# EAGLE design lora-sensor (EAGLE 9.6.2)
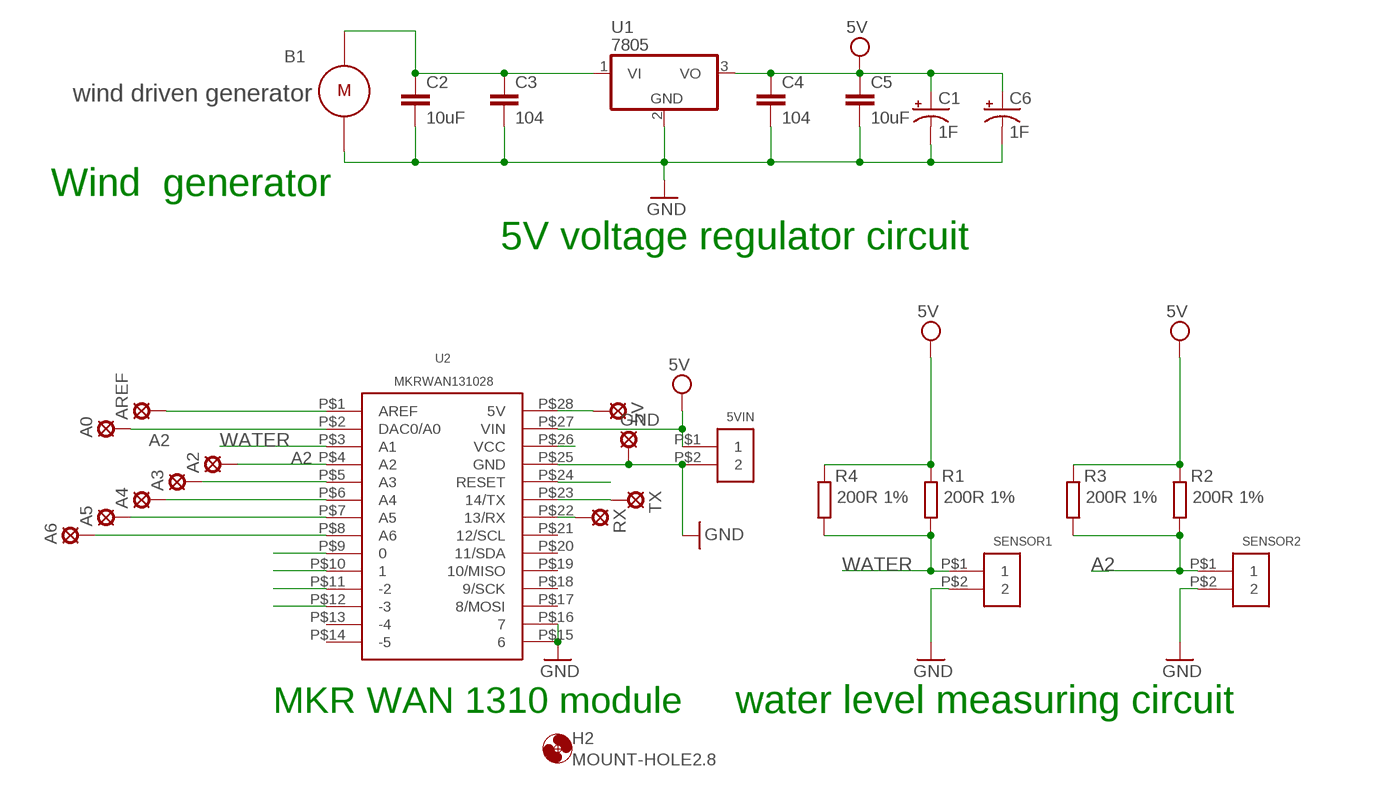
[diagram p0: schematic, sheet 1]

## Parts
5V  SE14  [SE14]
5VIN  0-190ΩCON2  [CON-2]
A0  SE14  [SE14]
A2  SE14  [SE14]
A3  SE14  [SE14]
A4  SE14  [SE14]
A5  SE14  [SE14]
A6  SE14  [SE14]
AREF  SE14  [SE14]
B1  wind driven generator  MOTOR  [MOTOR]
C1  1F  CPOL-USE3.5-8  [E3,5-8]
C2  10uF  C-EU025-030X050  [C025-030X050]
C3  104  C-EU025-030X050  [C025-030X050]
C4  104  C-EU025-030X050  [C025-030X050]
C5  10uF  C-EU025-030X050  [C025-030X050]
C6  1F  CPOL-USE3.5-8  [E3,5-8]
GND  SE14  [SE14]
H2  MOUNT-HOLE2.8  [2,8]
R1  200R 1%  R-EU_0309/12  [0309/12]
R2  200R 1%  R-EU_0309/12  [0309/12]
R3  200R 1%  R-EU_0309/12  [0309/12]
R4  200R 1%  R-EU_0309/12  [0309/12]
RX  SE14  [SE14]
SENSOR1  0-190ΩCON2  [CON-2]
SENSOR2  0-190ΩCON2  [CON-2]
TX  SE14  [SE14]
U1  7805  7812TV  [TO220V]
U2  MKRWAN131028  [28]

## Nets
5V [thicker]: 5VIN.P$1 C1.+ C4.1 C5.1 C6.+ U1.3(VO) U2.P$27(VIN)
A2 [thicker]: A2.MP R2.2 R3.2 SENSOR2.P$1 U2.P$4(A2)
GND [thicker]: 5VIN.P$2 B1.P$2 C1.- C2.2 C3.2 C4.2 C5.2 C6.- GND.MP SENSOR1.P$2 SENSOR2.P$2 U1.2(GND) U2.P$15 U2.P$16 U2.P$25(GND)
N$1 [thicker]: B1.P$1 C2.1 C3.1 U1.1(VI)
N$2 [thicker]: U2.P$24(RESET)
N$5 [thicker]: A3.MP U2.P$5(A3)
N$6 [thicker]: A4.MP U2.P$6(A4)
N$7 [thicker]: A5.MP U2.P$7(A5)
N$8 [thicker]: A6.MP U2.P$8(A6)
N$9 [thicker]: U2.P$9
N$10 [thicker]: U2.P$10
N$11 [thicker]: U2.P$11(-2)
N$12 [thicker]: U2.P$12(-3)
N$13 [thicker]: A0.MP U2.P$2(DAC0/A0)
N$14 [thicker]: AREF.MP U2.P$1(AREF)
N$15 [thicker]: U2.P$26(VCC)
N$16: 5V.MP U2.P$28(5V)
N$17 [thicker]: TX.MP U2.P$23(14/TX)
N$18 [thicker]: RX.MP U2.P$22(13/RX)
WATER [thicker]: R1.2 R2.1 R3.1 R4.2 SENSOR1.P$1 U2.P$3(A1) ; supply symbol labelled 5V
WATER1 [thicker]: R1.1 R4.1 ; supply symbol labelled 5V
Unconnected: U2.P$13(-4) U2.P$14(-5) U2.P$17(8/MOSI) U2.P$18(9/SCK) U2.P$19(10/MISO) U2.P$20(11/SDA) U2.P$21(12/SCL)

## Notes on the sheet
- Wind  generator
- 5V voltage regulator circuit
- MKR WAN 1310 module | water level measuring circuit

## Library data of the parts
5V A0 A2-A6 AREF GND RX TX = solpad:SE14: SOLDER PAD E1553, drill 1,4mm, distributor Buerklin, 07F820
5VIN SENSOR1 SENSOR2 = untitled:0-190Ω
B1 = untitled:MOTOR
C1 C6 = adafruit:CPOL-US: POLARIZED CAPACITOR, American symbol
C2-C5 = rcl:C-EU: CAPACITOR, European symbol; SPICEPREFIX: C
H2 = holes:MOUNT-HOLE: MOUNTING HOLE with drill center marker
R1-R4 = rcl:R-EU_: RESISTOR, European symbol; SPICEPREFIX: R
U1 = linear:78*: Positive VOLTAGE REGULATOR Source: http://cache.national.com/ds/LM/LM78L05.pdf http://www.fairchildsemi.com/ds/LM/LM7805.pdf
U2 = untitled:MKRWAN1310

## Net classes
1 thicker: width 0.203 mm, clearance 0.102 mm

## Board
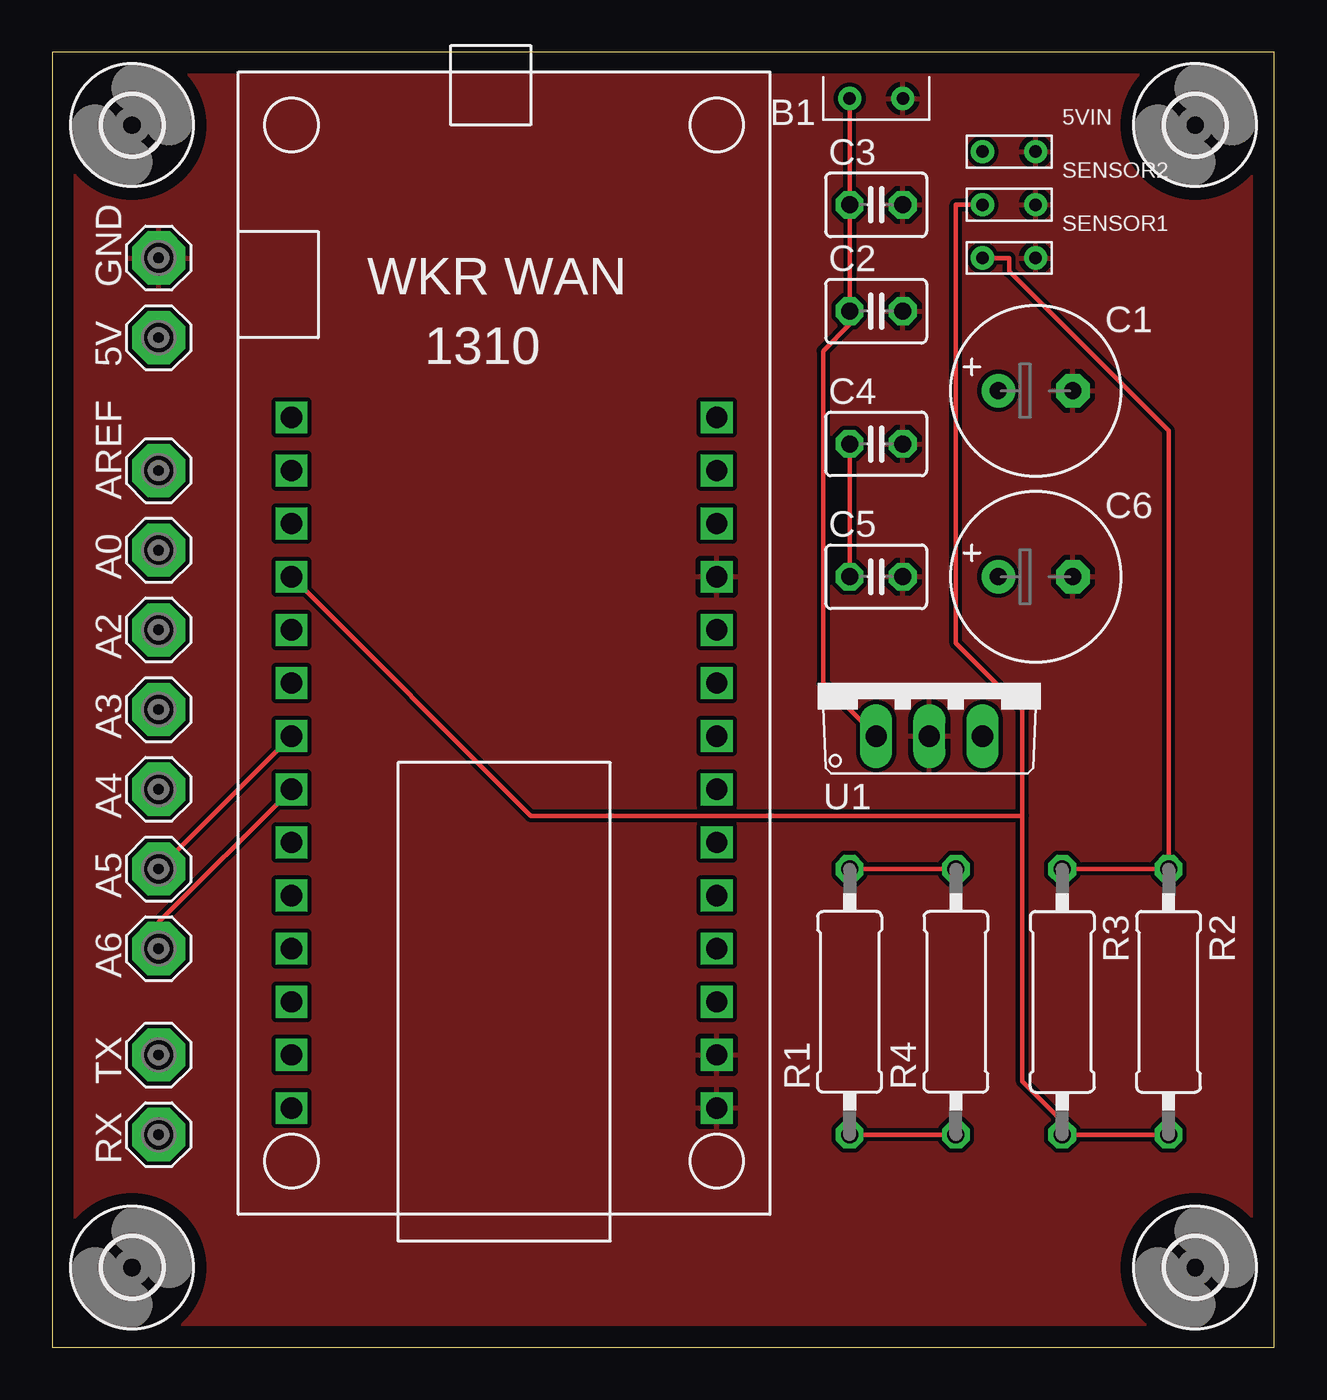
[diagram p1: board, top side]
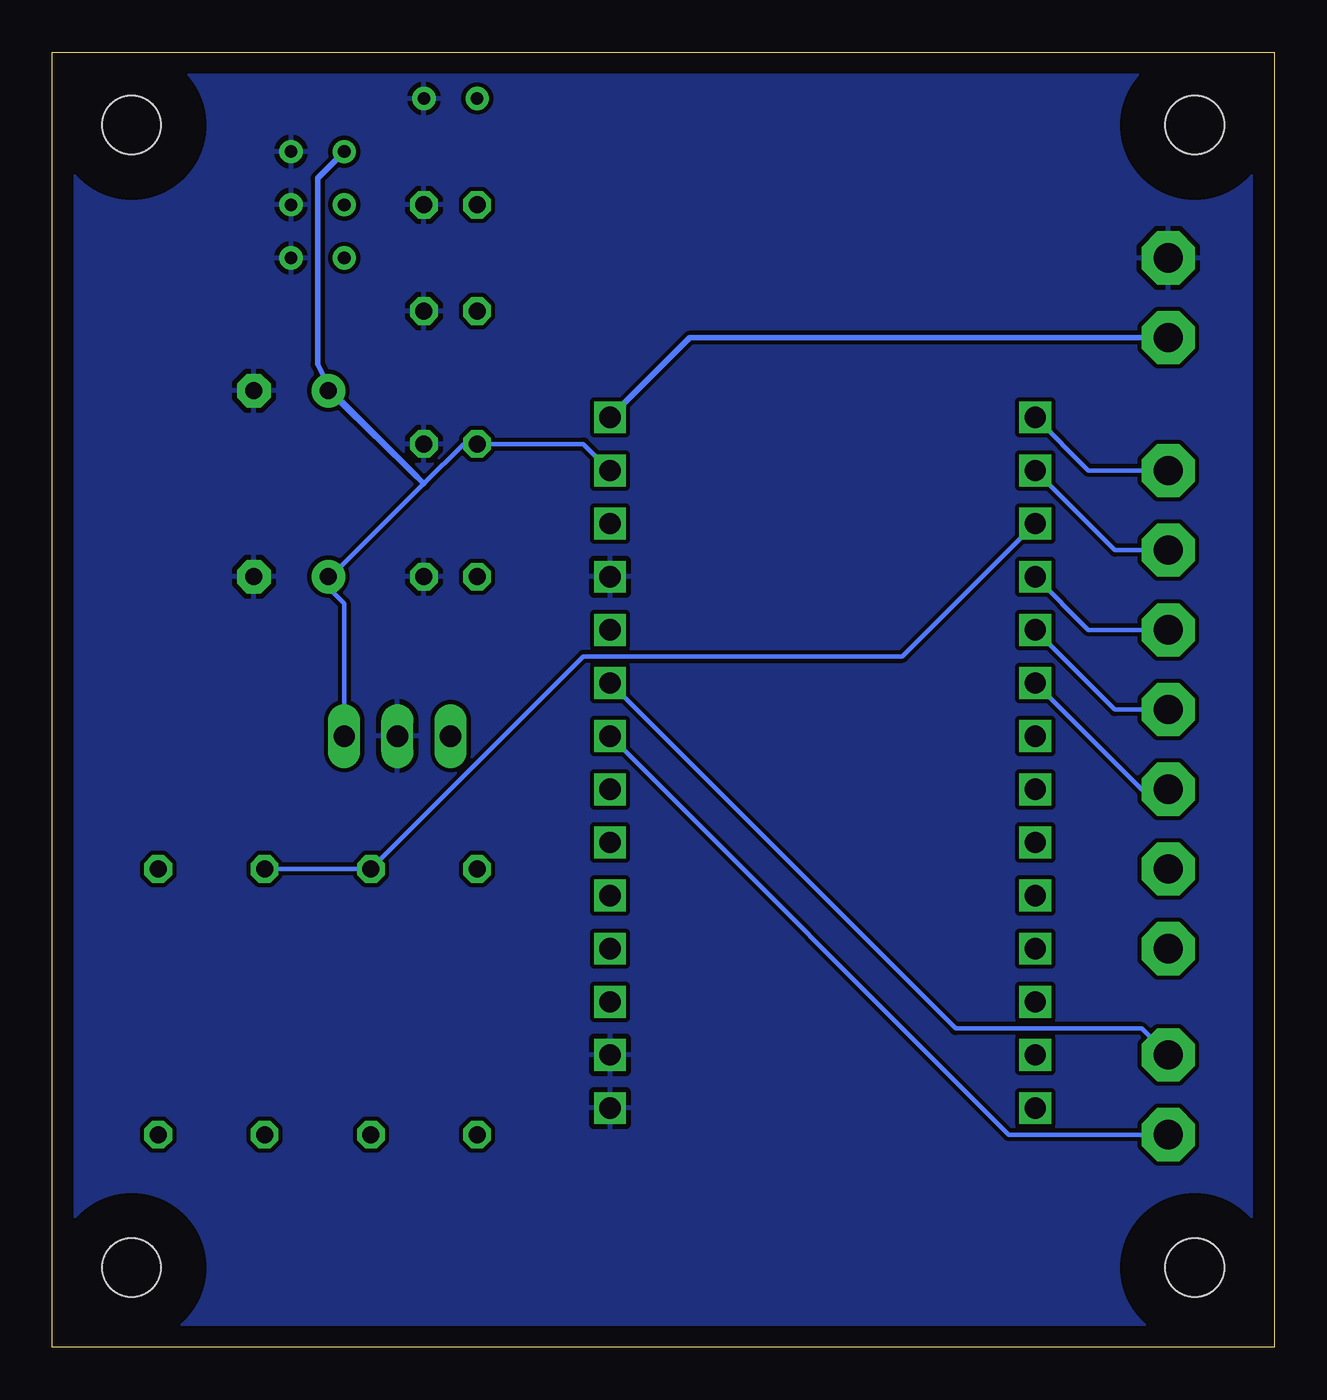
[diagram p2: board, bottom side, seen from below]

Size 58.4 x 61.9 mm. Coordinates in mm from the lower left corner, seen from the top.
Outline: 0,0 58.4,0 58.4,61.9 0,61.9 0,0
Copper layers (1*16): Top 0.035mm / dielectric 1.5mm / Bottom 0.035mm
Design rules "PCBWay": minimum track width 6mil, minimum drill 0.3mm, track to track 0.205mm, track to pad 0.205mm, pad to pad 0.205mm, via to via 0.205mm, smd to smd 8mil, copper to edge 40mil, drill to drill 8mil, minimum pad ring 10mil, minimum via ring 8mil, stop-mask expansion 4mil, vias tented up to drill 25mil, thermal gap 10mil

### Footprints (pad centres in the part's own frame; a part is rotated, then mirrored left to right if it is on the bottom)
SE14 = drill 1.397 pad 2.54 octagon: MP 0,0
CON-2 = drill 0.6: P$1 0,0; P$2 2.54,0
MOTOR = drill 0.6: P$1 -1.27,0; P$2 1.27,0
E3,5-8 = drill 0.813 pad 1.6: + -1.778,0 | drill 0.813 pad 1.6 octagon: - 1.778,0
C025-030X050 = drill 0.813 octagon: 1 -1.27,0; 2 1.27,0
2,8 = hole 2.8: 0,0
0309/12 = drill 0.813 octagon: 1 -6.35,0; 2 6.35,0
TO220V = drill 1.016 long: 1 -2.54,-2.54; 2 0,-2.54; 3 2.54,-2.54
28 = drill 1.016 square: P$1 0,0; P$2 0,-2.54; P$3 0,-5.08; P$4 0,-7.62; P$5 0,-10.16; P$6 0,-12.7; P$7 0,-15.24; P$8 0,-17.78; P$9 0,-20.32; P$10 0,-22.86; P$11 0,-25.4; P$12 0,-27.94; P$13 0,-30.48; P$14 0,-33.02; P$15 20.32,-33.02; P$16 20.32,-30.48; P$17 20.32,-27.94; P$18 20.32,-25.4; P$19 20.32,-22.86; P$20 20.32,-20.32; P$21 20.32,-17.78; P$22 20.32,-15.24; P$23 20.32,-12.7; P$24 20.32,-10.16; P$25 20.32,-7.62; P$26 20.32,-5.08; P$27 20.32,-2.54; P$28 20.32,0

### Placement (x,y rotation side)
5V  5.08,48.26 90 top
5VIN  44.45,57.15 0 top
A0  5.08,38.1 90 top
A2  5.08,34.29 90 top
A3  5.08,30.48 90 top
A4  5.08,26.67 90 top
A5  5.08,22.86 90 top
A6  5.08,19.05 90 top
AREF  5.08,41.91 90 top
B1  39.37,59.69 0 top
C1  46.99,45.72 0 top
C2  39.37,49.53 0 top
C3  39.37,54.61 0 top
C4  39.37,43.18 0 top
C5  39.37,36.83 0 top
C6  46.99,36.83 0 top
GND  5.08,52.07 90 top
H1  MOUNT-HOLE2.8  [2,8]  3.81,3.81 0 top
H2  3.81,58.42 0 top
H9  MOUNT-HOLE2.8  [2,8]  54.61,3.81 0 top
H10  MOUNT-HOLE2.8  [2,8]  54.61,58.42 0 top
R1  38.1,16.51 90 top
R2  53.34,16.51 270 top
R3  48.26,16.51 270 top
R4  43.18,16.51 90 top
RX  5.08,10.16 90 top
SENSOR1  44.45,52.07 0 top
SENSOR2  44.45,54.61 0 top
TX  5.08,13.97 90 top
U1  41.91,31.75 0 top
U2  11.43,44.45 0 top

### Tracks (layer width: path | path; a pad name or v marks a point on that pad's centre or on a via)
5V
  Top 0.203: C4.1 C5.1
  Bottom 0.203: U1.3 44.45,35.56 45.72,36.83 C6.+ 45.09,36.83 40.64,41.27 | U2.P$27 33.02,43.18 C4.1 38.73,43.18 40.64,41.27 | 40.64,41.27 40.96,41.59
  Bottom 0.254: 5VIN.P$1 45.72,55.88 45.72,46.99 45.09,45.72 | 40.96,41.59 45.09,45.72 | 45.09,45.72 C1.+ 40.64,41.27
A2
  Top 0.203: SENSOR2.P$1 43.18,54.61 43.18,33.65 46.35,30.48 46.35,25.4 | 46.35,25.4 46.35,12.7 48.26,10.8 R3.2 R2.2 | U2.P$4 22.86,25.4 46.35,25.4
  Bottom 0.203: U2.P$4 8.89,34.29 A2.MP
GND
  pour Top: 0,62.23 59.69,62.23 59.69,-3.81 -1.27,-3.81 -1.27,62.23
  pour Bottom: -1.27,63.5 60.96,63.5 60.96,-2.54 -1.27,-2.54
N$1
  Top 0.203: B1.P$1 C3.1 C2.1 38.1,48.9 36.83,47.62 36.83,31.75 U1.1
N$5
  Bottom 0.203: U2.P$5 7.62,30.48 A3.MP
N$6
  Bottom 0.203: U2.P$6 6.35,26.67 A4.MP
N$7
  Top 0.203: A5.MP U2.P$7
N$8
  Top 0.203: U2.P$8 5.08,20.32 A6.MP
N$13
  Bottom 0.203: U2.P$2 7.62,38.1 A0.MP
N$14
  Bottom 0.203: U2.P$1 8.89,41.91 AREF.MP
N$16
  Bottom 0.254: 5V.MP 27.94,48.26 U2.P$28
N$17
  Bottom 0.203: U2.P$23 15.24,15.24 6.35,15.24 TX.MP
N$18
  Bottom 0.203: U2.P$22 12.7,10.16 RX.MP
WATER
  Top 0.203: SENSOR1.P$1 45.72,52.07 45.72,51.43 53.34,43.82 R2.1 R3.1 | R4.2 R1.2
  Bottom 0.203: U2.P$3 17.78,33.02 32.38,33.02 33.02,33.02 R4.2 R3.1
WATER1
  Top 0.203: R4.1 R1.1

### Text on the board
Drills: NYU Wireless / Columbia IRT Lab
Name: LoRa Flood Sensor | 2023 Caspar Lant and Siming Jiang